# EAGLE schematic relay_sch (EAGLE 9.7.0)
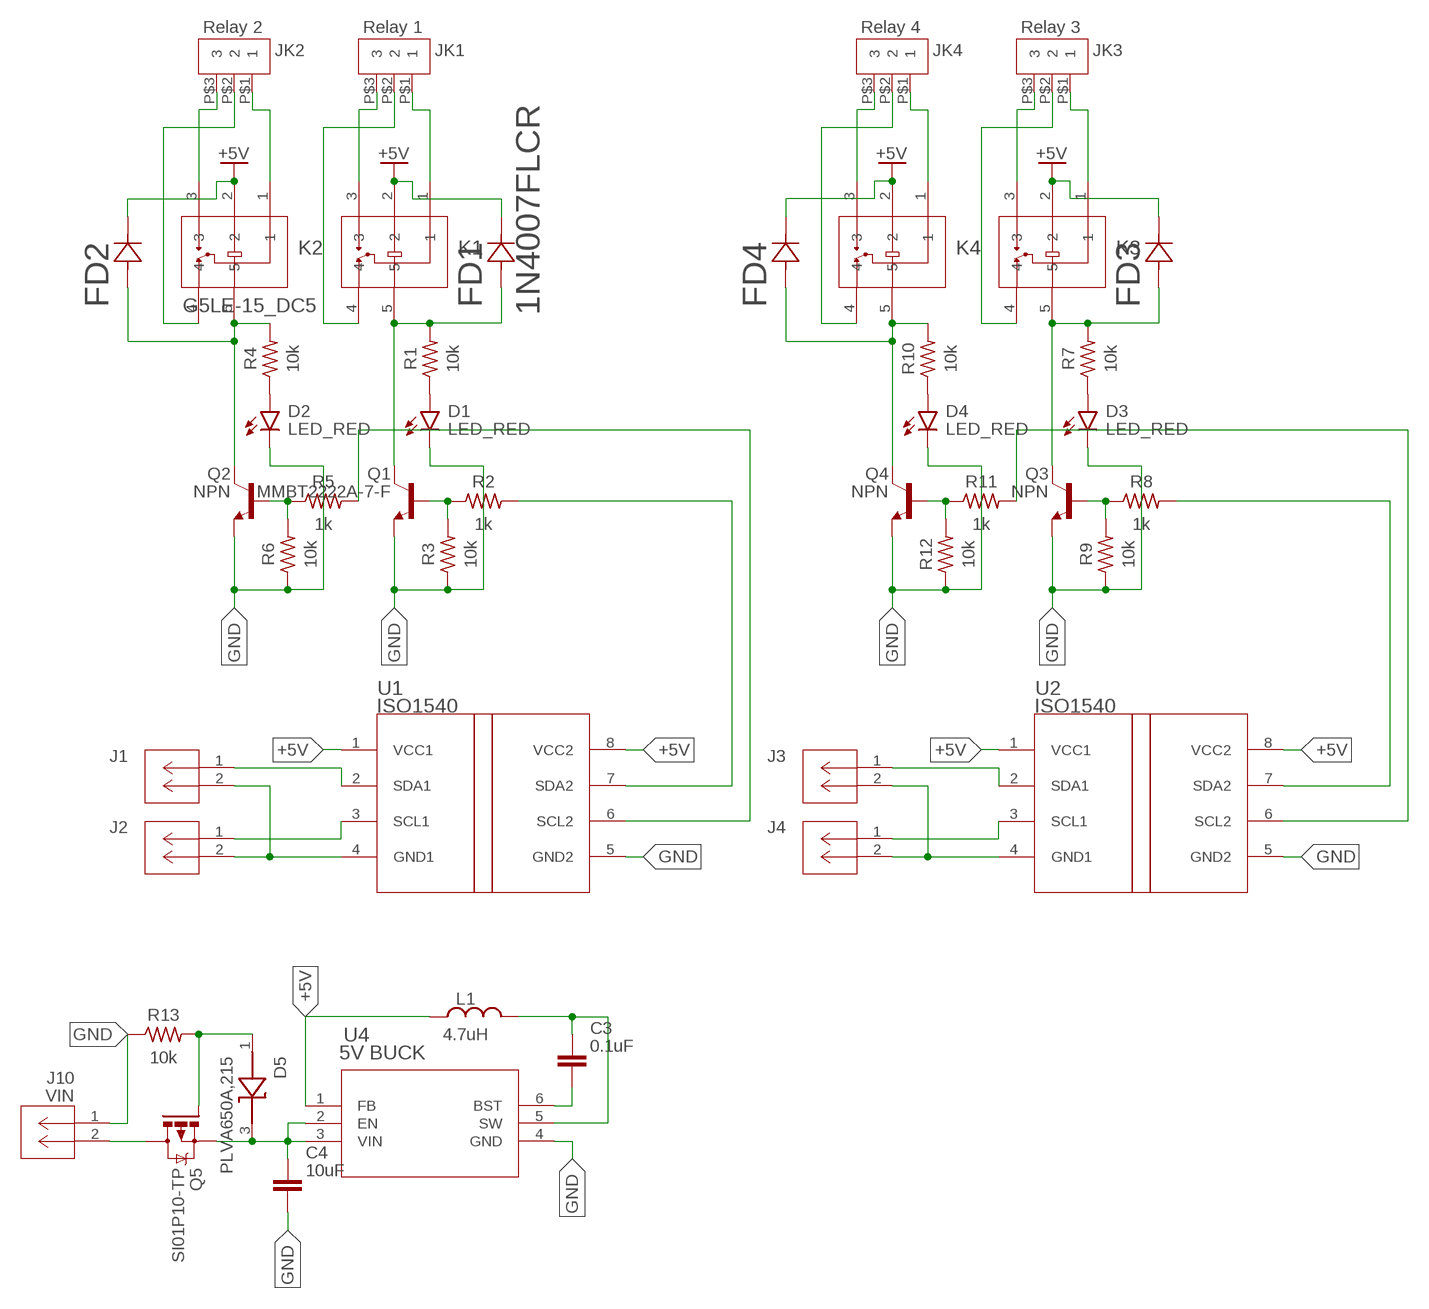
[diagram p0: schematic, sheet 1]

## Parts
C3  0.1uF  C_CHIP-0603(1608-METRIC)  [CAPC1608X85]
C4  10uF  C_CHIP-0603(1608-METRIC)  [CAPC1608X85]
D1  LED_RED  CHIP-FLAT-R_0603-0.55MM  [LEDC1608X55N_FLAT-R]
D2  LED_RED  CHIP-FLAT-R_0603-0.55MM  [LEDC1608X55N_FLAT-R]
D3  LED_RED  CHIP-FLAT-R_0603-0.55MM  [LEDC1608X55N_FLAT-R]
D4  LED_RED  CHIP-FLAT-R_0603-0.55MM  [LEDC1608X55N_FLAT-R]
D5  PLVA650A,215  [SOT95P230X110-3N]
FD1  1N4007FLCR  1N4007FLCR_SOD-123FL_SME-L  [CR_SOD-123FL_SME-L]
FD2  1N4007FLCR_SOD-123FL_SME-L  [CR_SOD-123FL_SME-L]
FD3  1N4007FLCR_SOD-123FL_SME-L  [CR_SOD-123FL_SME-L]
FD4  1N4007FLCR_SOD-123FL_SME-L  [CR_SOD-123FL_SME-L]
J1  MICROLOCK-2PIN  [2PIN]
J2  MICROLOCK-2PIN  [2PIN]
J3  MICROLOCK-2PIN  [2PIN]
J4  MICROLOCK-2PIN  [2PIN]
J10  VIN  2PINCON_436500201_MOL  [2PIN]
JK1  Relay 1  TERM-3,5-3  [TERM-3,5MM]
JK2  Relay 2  TERM-3,5-3  [TERM-3,5MM]
JK3  Relay 3  TERM-3,5-3  [TERM-3,5MM]
JK4  Relay 4  TERM-3,5-3  [TERM-3,5MM]
K1  G5LE-14_DC12RELAY_G5LE-1_DC5_OMR  [RELAY_G5LE-1_DC5_OMR]
K2  G5LE-15_DC5  G5LE-14_DC12RELAY_G5LE-1_DC5_OMR  [RELAY_G5LE-1_DC5_OMR]
K3  G5LE-14_DC12RELAY_G5LE-1_DC5_OMR  [RELAY_G5LE-1_DC5_OMR]
K4  G5LE-14_DC12RELAY_G5LE-1_DC5_OMR  [RELAY_G5LE-1_DC5_OMR]
L1  4.7uH  L_CHIP-0603(1608-METRIC)  [INDC1608X95N]
Q1  MMBT2222A-7-F  NPN_SOT23-BEC  [SOT95P237X112-3N]
Q2  NPN  NPN_SOT23-BEC  [SOT95P237X112-3N]
Q3  NPN  NPN_SOT23-BEC  [SOT95P237X112-3N]
Q4  NPN  NPN_SOT23-BEC  [SOT95P237X112-3N]
Q5  SI01P10-TP  PMOSFET_SOT23-GSD  [SOT23]
R1  10k  R-US_CHIP-0805(2012-METRIC)  [RESC2012X65]
R2  1k  R-US_CHIP-0603(1608-METRIC)  [RESC1608X60]
R3  10k  R-US_CHIP-0603(1608-METRIC)  [RESC1608X60]
R4  10k  R-US_CHIP-0805(2012-METRIC)  [RESC2012X65]
R5  1k  R-US_CHIP-0603(1608-METRIC)  [RESC1608X60]
R6  10k  R-US_CHIP-0603(1608-METRIC)  [RESC1608X60]
R7  10k  R-US_CHIP-0805(2012-METRIC)  [RESC2012X65]
R8  1k  R-US_CHIP-0603(1608-METRIC)  [RESC1608X60]
R9  10k  R-US_CHIP-0603(1608-METRIC)  [RESC1608X60]
R10  10k  R-US_CHIP-0805(2012-METRIC)  [RESC2012X65]
R11  1k  R-US_CHIP-0603(1608-METRIC)  [RESC1608X60]
R12  10k  R-US_CHIP-0603(1608-METRIC)  [RESC1608X60]
R13  10k  R-US_CHIP-0603(1608-METRIC)  [RESC1608X60]
U1  ISO1540  ISO1540D0008A_N  [SOIC-8]
U2  ISO1540  ISO1540D0008A_N  [SOIC-8]
U4  5V BUCK  AP63205SOIC_05WU-7_DIO  [AP63205]

## Nets
+5V: FD1.1(CATHODE) FD2.1(CATHODE) FD3.1(CATHODE) FD4.1(CATHODE) K1.2 K2.2 K3.2 K4.2 L1.1 U1.1(VCC1) U1.8(VCC2) U2.1(VCC1) U2.8(VCC2) U4.1(FB)
GND: C4.2 D1.C D2.C D3.C D4.C J10.1 Q1.2(E) Q2.2(E) Q3.2(E) Q4.2(E) R3.1 R6.1 R9.1 R12.1 R13.1 U1.5(GND2) U2.5(GND2) U4.4(GND)
N$1: JK1.P$3 K1.3
N$2: JK1.P$1 K1.1
N$3: JK1.P$2 K1.4
N$4: FD1.2(ANODE) K1.5 Q1.3(C) R1.2
N$5: FD2.2(ANODE) K2.5 Q2.3(C) R4.2
N$6: Q1.1(B) R2.1 R3.2
N$7: JK2.P$3 K2.3
N$8: R2.2 U1.7(SDA2)
N$9: J1.1 U1.2(SDA1)
N$10: J2.1 U1.3(SCL1)
N$11: J1.2 J2.2 U1.4(GND1)
N$12: JK2.P$1 K2.1
N$13: FD4.2(ANODE) K4.5 Q4.3(C) R10.2
N$14: FD3.2(ANODE) K3.5 Q3.3(C) R7.2
N$15: Q2.1(B) R5.1 R6.2
N$16: JK2.P$2 K2.4
N$17: R5.2 U1.6(SCL2)
N$18: JK3.P$3 K3.3
N$19: JK3.P$1 K3.1
N$20: D2.A R4.1
N$21: D3.A R7.1
N$22: Q3.1(B) R8.1 R9.2
N$23: JK3.P$2 K3.4
N$24: J3.1 U2.2(SDA1)
N$25: R8.2 U2.7(SDA2)
N$26: J4.1 U2.3(SCL1)
N$27: J3.2 J4.2 U2.4(GND1)
N$28: JK4.P$3 K4.3
N$29: JK4.P$1 K4.1
N$30: D1.A R1.1
N$31: D4.A R10.1
N$32: Q4.1(B) R11.1 R12.2
N$33: JK4.P$2 K4.4
N$34: R11.2 U2.6(SCL2)
N$36: C3.2 U4.6(BST)
N$37: C3.1 L1.2 U4.5(SW)
N$38: J10.2 Q5.3(D)
N$39: C4.1 D5.3(C) Q5.2(S) U4.2(EN) U4.3(VIN)
N$40: D5.1(A) Q5.1(G) R13.2

## Library data of the parts
C3 C4 = Capacitor:C: Capacitor - Generic; CATEGORY: Capacitor
D1-D4 = LED:CHIP-FLAT-R; CATEGORY: LED; COLOR: RED; DESCRIPTION: CHIP LED FLAT; SUB-CATEGORY: CHIP; TYPE: FLAT_TOP
D5 = PLVA650A_215:PLVA650A,215: PLVA6xxA Series 5 V 250 mW SMT Avalanche Regulator Diode - SOT-23-3; AVAILABILITY: Good; MF: NXP; MP: PLVA650A,215; PACKAGE: SOT95P230X110-3N; PRICE: $0.13 USD
FD1-FD4 = 2024-02-25_07-03-28_Library:1N4007FL; COPYRIGHT: Copyright (C) 2024 Ultra Librarian. All rights reserved.; MANUFACTURER_PART_NUMBER: 1N4007FL; MFR_NAME: SMC Diode Solutions
J1-J4 = Molex Micro-Lock PLUS:MICROLOCK-2PIN
J10 = Molex Micro-Fit:2PIN; COPYRIGHT: Copyright (C) 2022 Ultra Librarian. All rights reserved.; MANUFACTURER_PART_NUMBER: 436500201; MFR_NAME: Molex Connector Corporation
JK1-JK4 = Screw Terminal (3.5mm):TERM-3,5-3
K1-K4 = G5LE-14 DC3:G5LE-14_DC12; COPYRIGHT: Copyright (C) 2022 Ultra Librarian. All rights reserved.; MANUFACTURER_PART_NUMBER: G5LE-14 DC12; MFR_NAME: Omron
L1 = Inductor:L: Inductor Fixed - Generic; CATEGORY: Inductor; SUB-CATEGORY: Fixed
Q1 = Transistor:NPN: NPN - Generic; CATEGORY: Transistor; SUB-CATEGORY: BJT; TYPE: NPN; VALUE: NPN
Q2-Q4 = Transistor:NPN: NPN - Generic; CATEGORY: Transistor; SUB-CATEGORY: BJT; TYPE: NPN
Q5 = Transistor:PMOSFET: P-Channel MOSFET - Generic; CATEGORY: Transistor; SUB-CATEGORY: MOSFET; TYPE: P-Channel; VALUE: PMOSFET
R1-R13 = Resistor:R-US: Resistor Fixed - ANSI; CATEGORY: Resistor; SUB-CATEGORY: Fixed
U1 U2 = ISO1540 I2C Isolator:ISO1540; COPYRIGHT: Copyright (C) 2022 Ultra Librarian. All rights reserved.; MANUFACTURER_PART_NUMBER: ISO1540DR; MFR_NAME: Texas Instruments; REFDES: RefDes; TYPE: TYPE
U4 = AP63205:AP63205; COPYRIGHT: Copyright (C) 2022 Ultra Librarian. All rights reserved.; MANUFACTURER_PART_NUMBER: AP63205WU-7; MFR_NAME: Diodes Inc